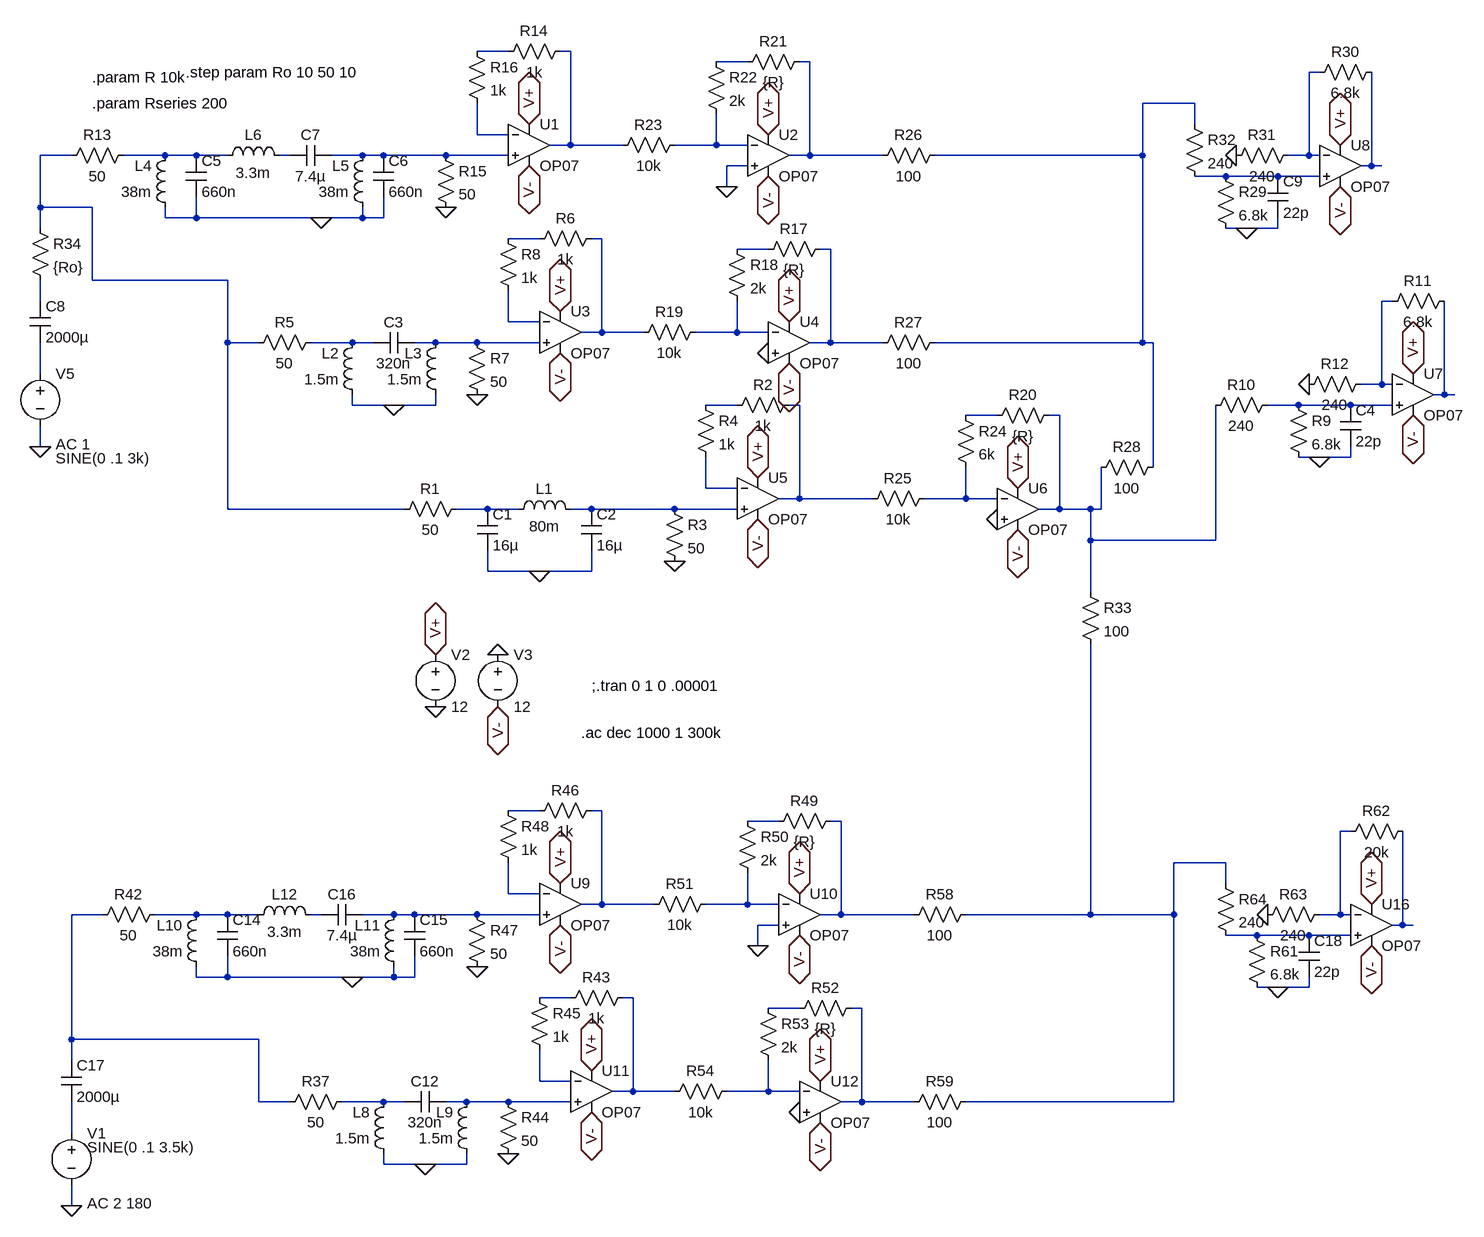
[diagram p0: schematic use_this_for_simulations_on_Mac_test_singleBASS.asc]
use_this_for_simulations_on_Mac_test_singleBASS.asc, the LTspice schematic file:
Version 4
SHEET 1 1344 1392
WIRE -176 -592 -224 -592
WIRE -80 -592 -96 -592
WIRE 192 -576 144 -576
WIRE 288 -576 272 -576
WIRE 1072 -560 1056 -560
WIRE 880 -512 800 -512
WIRE 880 -480 880 -512
WIRE -224 -464 -224 -512
WIRE -176 -464 -224 -464
WIRE -80 -448 -80 -592
WIRE -80 -448 -112 -448
WIRE 0 -448 -80 -448
WIRE 144 -448 144 -496
WIRE 144 -448 80 -448
WIRE 192 -448 144 -448
WIRE -848 -432 -896 -432
WIRE -704 -432 -768 -432
WIRE -656 -432 -704 -432
WIRE -608 -432 -656 -432
WIRE -512 -432 -528 -432
WIRE -400 -432 -448 -432
WIRE -368 -432 -400 -432
WIRE -272 -432 -368 -432
WIRE -176 -432 -272 -432
WIRE 288 -432 288 -576
WIRE 288 -432 256 -432
WIRE 400 -432 288 -432
WIRE 800 -432 800 -512
WIRE 800 -432 480 -432
WIRE 1056 -432 1056 -560
WIRE 1056 -432 1024 -432
WIRE 1072 -432 1056 -432
WIRE 192 -416 160 -416
WIRE 1152 -416 1152 -560
WIRE 1152 -416 1136 -416
WIRE 1168 -416 1152 -416
WIRE 928 -400 880 -400
WIRE 1008 -400 928 -400
WIRE 1072 -400 1008 -400
WIRE 160 -384 160 -416
WIRE -896 -352 -896 -432
WIRE -816 -352 -896 -352
WIRE -704 -336 -704 -352
WIRE -656 -336 -656 -368
WIRE -656 -336 -704 -336
WIRE -464 -336 -656 -336
WIRE -400 -336 -400 -352
WIRE -400 -336 -464 -336
WIRE -368 -336 -368 -368
WIRE -368 -336 -400 -336
WIRE -896 -320 -896 -352
WIRE 960 -320 928 -320
WIRE 1008 -320 1008 -336
WIRE 1008 -320 960 -320
WIRE -128 -304 -176 -304
WIRE -32 -304 -48 -304
WIRE 224 -288 176 -288
WIRE 320 -288 304 -288
WIRE -816 -240 -816 -352
WIRE -608 -240 -816 -240
WIRE -896 -208 -896 -240
WIRE 1184 -208 1168 -208
WIRE -176 -176 -176 -224
WIRE -128 -176 -176 -176
WIRE -32 -160 -32 -304
WIRE -32 -160 -64 -160
WIRE 32 -160 -32 -160
WIRE 176 -160 176 -208
WIRE 176 -160 112 -160
WIRE 224 -160 176 -160
WIRE -608 -144 -608 -240
WIRE -560 -144 -608 -144
WIRE -416 -144 -480 -144
WIRE -384 -144 -416 -144
WIRE -288 -144 -320 -144
WIRE -224 -144 -288 -144
WIRE -128 -144 -224 -144
WIRE 320 -144 320 -288
WIRE 320 -144 288 -144
WIRE 400 -144 320 -144
WIRE 800 -144 800 -432
WIRE 800 -144 480 -144
WIRE 816 -144 800 -144
WIRE -896 -96 -896 -144
WIRE 1168 -80 1168 -208
WIRE 1168 -80 1136 -80
WIRE 1184 -80 1168 -80
WIRE 1264 -64 1264 -208
WIRE 1264 -64 1248 -64
WIRE 1280 -64 1264 -64
WIRE -416 -48 -416 -64
WIRE -352 -48 -416 -48
WIRE -288 -48 -288 -64
WIRE -288 -48 -352 -48
WIRE 176 -48 128 -48
WIRE 272 -48 256 -48
WIRE 1040 -48 992 -48
WIRE 1120 -48 1040 -48
WIRE 1184 -48 1120 -48
WIRE 576 -32 528 -32
WIRE 672 -32 656 -32
WIRE -896 16 -896 -16
WIRE 1072 32 1040 32
WIRE 1120 32 1120 16
WIRE 1120 32 1072 32
WIRE 816 48 816 -144
WIRE 128 80 128 32
WIRE 176 80 128 80
WIRE 272 96 272 -48
WIRE 272 96 240 96
WIRE 384 96 272 96
WIRE 528 96 528 48
WIRE 528 96 464 96
WIRE 576 96 528 96
WIRE -608 112 -608 -144
WIRE -336 112 -608 112
WIRE -208 112 -256 112
WIRE -160 112 -208 112
WIRE -48 112 -80 112
WIRE 80 112 -48 112
WIRE 176 112 80 112
WIRE 672 112 672 -32
WIRE 672 112 640 112
WIRE 720 112 672 112
WIRE 736 112 736 48
WIRE 736 112 720 112
WIRE 720 160 720 112
WIRE 912 160 912 -48
WIRE 912 160 720 160
WIRE -208 208 -208 176
WIRE -128 208 -208 208
WIRE -48 208 -48 176
WIRE -48 208 -128 208
WIRE 720 240 720 160
WIRE -128 576 -176 576
WIRE -32 576 -48 576
WIRE 240 592 192 592
WIRE 336 592 320 592
WIRE 1120 608 1104 608
WIRE 928 656 848 656
WIRE 928 688 928 656
WIRE -176 704 -176 656
WIRE -128 704 -176 704
WIRE -32 720 -32 576
WIRE -32 720 -64 720
WIRE 48 720 -32 720
WIRE 192 720 192 672
WIRE 192 720 128 720
WIRE 240 720 192 720
WIRE -800 736 -848 736
WIRE -656 736 -720 736
WIRE -608 736 -656 736
WIRE -560 736 -608 736
WIRE -464 736 -480 736
WIRE -352 736 -400 736
WIRE -320 736 -352 736
WIRE -224 736 -320 736
WIRE -128 736 -224 736
WIRE 336 736 336 592
WIRE 336 736 304 736
WIRE 448 736 336 736
WIRE 720 736 720 320
WIRE 720 736 528 736
WIRE 848 736 848 656
WIRE 848 736 720 736
WIRE 1104 736 1104 608
WIRE 1104 736 1072 736
WIRE 1120 736 1104 736
WIRE 240 752 208 752
WIRE 1200 752 1200 608
WIRE 1200 752 1184 752
WIRE 1216 752 1200 752
WIRE 976 768 928 768
WIRE 1056 768 976 768
WIRE 1120 768 1056 768
WIRE 208 784 208 752
WIRE -656 832 -656 816
WIRE -608 832 -608 800
WIRE -608 832 -656 832
WIRE -416 832 -608 832
WIRE -352 832 -352 816
WIRE -352 832 -416 832
WIRE -320 832 -320 800
WIRE -320 832 -352 832
WIRE 1008 848 976 848
WIRE 1056 848 1056 832
WIRE 1056 848 1008 848
WIRE -80 864 -128 864
WIRE 16 864 0 864
WIRE 272 880 224 880
WIRE 368 880 352 880
WIRE -848 928 -848 736
WIRE -560 928 -848 928
WIRE -848 960 -848 928
WIRE -128 992 -128 944
WIRE -80 992 -128 992
WIRE 16 1008 16 864
WIRE 16 1008 -16 1008
WIRE 80 1008 16 1008
WIRE 224 1008 224 960
WIRE 224 1008 160 1008
WIRE 272 1008 224 1008
WIRE -560 1024 -560 928
WIRE -512 1024 -560 1024
WIRE -368 1024 -432 1024
WIRE -336 1024 -368 1024
WIRE -240 1024 -272 1024
WIRE -176 1024 -240 1024
WIRE -80 1024 -176 1024
WIRE 368 1024 368 880
WIRE 368 1024 336 1024
WIRE 448 1024 368 1024
WIRE 848 1024 848 736
WIRE 848 1024 528 1024
WIRE -848 1072 -848 1024
WIRE -368 1120 -368 1104
WIRE -304 1120 -368 1120
WIRE -240 1120 -240 1104
WIRE -240 1120 -304 1120
WIRE -848 1184 -848 1152
FLAG -288 336 V+
IOPIN -288 336 BiDir
FLAG 208 64 V+
IOPIN 208 64 BiDir
FLAG -192 416 V-
IOPIN -192 416 BiDir
FLAG 208 128 V-
IOPIN 208 128 BiDir
FLAG -192 336 0
FLAG -288 416 0
FLAG -128 208 0
FLAG -352 -48 0
FLAG 1216 -96 V+
IOPIN 1216 -96 BiDir
FLAG 1216 -32 V-
IOPIN 1216 -32 BiDir
FLAG 1072 32 0
FLAG 1056 -80 0
FLAG -896 16 0
FLAG -464 -336 0
FLAG 80 192 0
FLAG -96 -192 V+
IOPIN -96 -192 BiDir
FLAG -96 -128 V-
IOPIN -96 -128 BiDir
FLAG -224 -64 0
FLAG -144 -480 V+
IOPIN -144 -480 BiDir
FLAG -144 -416 V-
IOPIN -144 -416 BiDir
FLAG -272 -352 0
FLAG 224 -464 V+
IOPIN 224 -464 BiDir
FLAG 224 -400 V-
IOPIN 224 -400 BiDir
FLAG 256 -176 V+
IOPIN 256 -176 BiDir
FLAG 256 -112 V-
IOPIN 256 -112 BiDir
FLAG 608 80 V+
IOPIN 608 80 BiDir
FLAG 608 144 V-
IOPIN 608 144 BiDir
FLAG 224 -128 0
FLAG 160 -384 0
FLAG 576 128 0
FLAG 1104 -448 V+
IOPIN 1104 -448 BiDir
FLAG 1104 -384 V-
IOPIN 1104 -384 BiDir
FLAG 960 -320 0
FLAG 944 -432 0
FLAG -304 1120 0
FLAG -848 1184 0
FLAG -416 832 0
FLAG -48 976 V+
IOPIN -48 976 BiDir
FLAG -48 1040 V-
IOPIN -48 1040 BiDir
FLAG -176 1104 0
FLAG -96 688 V+
IOPIN -96 688 BiDir
FLAG -96 752 V-
IOPIN -96 752 BiDir
FLAG -224 816 0
FLAG 272 704 V+
IOPIN 272 704 BiDir
FLAG 272 768 V-
IOPIN 272 768 BiDir
FLAG 304 992 V+
IOPIN 304 992 BiDir
FLAG 304 1056 V-
IOPIN 304 1056 BiDir
FLAG 272 1040 0
FLAG 208 784 0
FLAG 1152 720 V+
IOPIN 1152 720 BiDir
FLAG 1152 784 V-
IOPIN 1152 784 BiDir
FLAG 1008 848 0
FLAG 992 736 0
SYMBOL voltage -288 320 R0
WINDOW 123 0 0 Left 2
WINDOW 39 0 0 Left 2
SYMATTR InstName V2
SYMATTR Value 12
SYMBOL voltage -192 320 R0
WINDOW 123 0 0 Left 2
WINDOW 39 0 0 Left 2
SYMATTR InstName V3
SYMATTR Value 12
SYMBOL res -240 96 R90
WINDOW 0 0 56 VBottom 2
WINDOW 3 32 56 VTop 2
SYMATTR InstName R1
SYMATTR Value 50
SYMBOL res 272 -64 R90
WINDOW 0 0 56 VBottom 2
WINDOW 3 32 56 VTop 2
SYMATTR InstName R2
SYMATTR Value 1k
SYMBOL cap -224 112 R0
SYMATTR InstName C1
SYMATTR Value 16µ
SYMBOL ind -176 128 R270
WINDOW 0 32 56 VTop 2
WINDOW 3 5 56 VBottom 2
SYMATTR InstName L1
SYMATTR Value 80m
SYMATTR SpiceLine Rser={Rseries}
SYMBOL cap -64 112 R0
SYMATTR InstName C2
SYMATTR Value 16µ
SYMBOL res 64 96 R0
SYMATTR InstName R3
SYMATTR Value 50
SYMBOL res 112 -64 R0
SYMATTR InstName R4
SYMATTR Value 1k
SYMBOL res -464 -160 R90
WINDOW 0 0 56 VBottom 2
WINDOW 3 32 56 VTop 2
SYMATTR InstName R5
SYMATTR Value 50
SYMBOL cap -384 -128 R270
WINDOW 0 32 32 VTop 2
WINDOW 3 0 32 VBottom 2
SYMATTR InstName C3
SYMATTR Value 320n
SYMBOL ind -400 -48 R180
WINDOW 0 36 80 Left 2
WINDOW 3 36 40 Left 2
SYMATTR InstName L2
SYMATTR Value 1.5m
SYMBOL ind -272 -48 R180
WINDOW 0 36 80 Left 2
WINDOW 3 36 40 Left 2
SYMATTR InstName L3
SYMATTR Value 1.5m
SYMBOL cap 1104 -48 R0
SYMATTR InstName C4
SYMATTR Value 22p
SYMBOL res 1024 -64 R0
SYMATTR InstName R9
SYMATTR Value 6.8k
SYMBOL res 896 -32 R270
WINDOW 0 32 56 VTop 2
WINDOW 3 0 56 VBottom 2
SYMATTR InstName R10
SYMATTR Value 240
SYMBOL res 1168 -192 R270
WINDOW 0 32 56 VTop 2
WINDOW 3 0 56 VBottom 2
SYMATTR InstName R11
SYMATTR Value 6.8k
SYMBOL res 1040 -64 R270
WINDOW 0 32 56 VTop 2
WINDOW 3 0 56 VBottom 2
SYMATTR InstName R12
SYMATTR Value 240
SYMBOL voltage -896 -112 R0
WINDOW 123 24 124 Left 2
WINDOW 39 0 0 Left 2
WINDOW 3 24 146 Left 2
SYMATTR Value2 AC 1
SYMATTR Value SINE(0 .1 3k)
SYMATTR InstName V5
SYMBOL res -752 -448 R90
WINDOW 0 0 56 VBottom 2
WINDOW 3 32 56 VTop 2
SYMATTR InstName R13
SYMATTR Value 50
SYMBOL ind -688 -336 R180
WINDOW 0 36 80 Left 2
WINDOW 3 36 40 Left 2
SYMATTR InstName L4
SYMATTR Value 38m
SYMBOL ind -384 -336 R180
WINDOW 0 36 80 Left 2
WINDOW 3 36 40 Left 2
SYMATTR InstName L5
SYMATTR Value 38m
SYMBOL cap -672 -432 R0
SYMATTR InstName C5
SYMATTR Value 660n
SYMBOL cap -384 -432 R0
SYMATTR InstName C6
SYMATTR Value 660n
SYMBOL ind -624 -416 R270
WINDOW 0 32 56 VTop 2
WINDOW 3 5 56 VBottom 2
SYMATTR InstName L6
SYMATTR Value 3.3m
SYMBOL cap -512 -416 R270
WINDOW 0 32 32 VTop 2
WINDOW 3 0 32 VBottom 2
SYMATTR InstName C7
SYMATTR Value 7.4µ
SYMBOL res -32 -320 R90
WINDOW 0 0 56 VBottom 2
WINDOW 3 32 56 VTop 2
SYMATTR InstName R6
SYMATTR Value 1k
SYMBOL res -240 -160 R0
SYMATTR InstName R7
SYMATTR Value 50
SYMBOL res -192 -320 R0
SYMATTR InstName R8
SYMATTR Value 1k
SYMBOL res -80 -608 R90
WINDOW 0 0 56 VBottom 2
WINDOW 3 32 56 VTop 2
SYMATTR InstName R14
SYMATTR Value 1k
SYMBOL res -288 -448 R0
SYMATTR InstName R15
SYMATTR Value 50
SYMBOL res -240 -608 R0
SYMATTR InstName R16
SYMATTR Value 1k
SYMBOL res 288 -592 R90
WINDOW 0 0 56 VBottom 2
WINDOW 3 32 56 VTop 2
SYMATTR InstName R21
SYMATTR Value {R}
SYMBOL res 128 -592 R0
SYMATTR InstName R22
SYMATTR Value 2k
SYMBOL res -16 -432 R270
WINDOW 0 32 56 VTop 2
WINDOW 3 0 56 VBottom 2
SYMATTR InstName R23
SYMATTR Value 10k
SYMBOL res 320 -304 R90
WINDOW 0 0 56 VBottom 2
WINDOW 3 32 56 VTop 2
SYMATTR InstName R17
SYMATTR Value {R}
SYMBOL res 160 -304 R0
SYMATTR InstName R18
SYMATTR Value 2k
SYMBOL res 16 -144 R270
WINDOW 0 32 56 VTop 2
WINDOW 3 0 56 VBottom 2
SYMATTR InstName R19
SYMATTR Value 10k
SYMBOL res 672 -48 R90
WINDOW 0 0 56 VBottom 2
WINDOW 3 32 56 VTop 2
SYMATTR InstName R20
SYMATTR Value {R}
SYMBOL res 512 -48 R0
SYMATTR InstName R24
SYMATTR Value 6k
SYMBOL res 368 112 R270
WINDOW 0 32 56 VTop 2
WINDOW 3 0 56 VBottom 2
SYMATTR InstName R25
SYMATTR Value 10k
SYMBOL res 384 -416 R270
WINDOW 0 32 56 VTop 2
WINDOW 3 0 56 VBottom 2
SYMATTR InstName R26
SYMATTR Value 100
SYMBOL res 384 -128 R270
WINDOW 0 32 56 VTop 2
WINDOW 3 0 56 VBottom 2
SYMATTR InstName R27
SYMATTR Value 100
SYMBOL res 720 64 R270
WINDOW 0 32 56 VTop 2
WINDOW 3 0 56 VBottom 2
SYMATTR InstName R28
SYMATTR Value 100
SYMBOL cap -912 -208 R0
SYMATTR InstName C8
SYMATTR Value 2000µ
SYMBOL Opamps/OP07 -144 -512 R0
SYMATTR InstName U1
SYMBOL Opamps/OP07 224 -496 R0
SYMATTR InstName U2
SYMBOL Opamps/OP07 -96 -224 R0
SYMATTR InstName U3
SYMBOL Opamps/OP07 256 -208 R0
SYMATTR InstName U4
SYMBOL Opamps/OP07 208 32 R0
SYMATTR InstName U5
SYMBOL Opamps/OP07 608 48 R0
SYMATTR InstName U6
SYMBOL Opamps/OP07 1216 -128 R0
SYMATTR InstName U7
SYMBOL cap 992 -400 R0
SYMATTR InstName C9
SYMATTR Value 22p
SYMBOL res 912 -416 R0
SYMATTR InstName R29
SYMATTR Value 6.8k
SYMBOL res 1056 -544 R270
WINDOW 0 32 56 VTop 2
WINDOW 3 0 56 VBottom 2
SYMATTR InstName R30
SYMATTR Value 6.8k
SYMBOL res 928 -416 R270
WINDOW 0 32 56 VTop 2
WINDOW 3 0 56 VBottom 2
SYMATTR InstName R31
SYMATTR Value 240
SYMBOL Opamps/OP07 1104 -480 R0
SYMATTR InstName U8
SYMBOL res 864 -496 R0
SYMATTR InstName R32
SYMATTR Value 240
SYMBOL res -416 1008 R90
WINDOW 0 0 56 VBottom 2
WINDOW 3 32 56 VTop 2
SYMATTR InstName R37
SYMATTR Value 50
SYMBOL cap -336 1040 R270
WINDOW 0 32 32 VTop 2
WINDOW 3 0 32 VBottom 2
SYMATTR InstName C12
SYMATTR Value 320n
SYMBOL ind -352 1120 R180
WINDOW 0 36 80 Left 2
WINDOW 3 36 40 Left 2
SYMATTR InstName L8
SYMATTR Value 1.5m
SYMBOL ind -224 1120 R180
WINDOW 0 36 80 Left 2
WINDOW 3 36 40 Left 2
SYMATTR InstName L9
SYMATTR Value 1.5m
SYMBOL voltage -848 1056 R0
WINDOW 123 24 124 Left 2
WINDOW 39 0 0 Left 2
WINDOW 3 24 38 Left 2
SYMATTR Value2 AC 2 180
SYMATTR Value SINE(0 .1 3.5k)
SYMATTR InstName V1
SYMBOL res -704 720 R90
WINDOW 0 0 56 VBottom 2
WINDOW 3 32 56 VTop 2
SYMATTR InstName R42
SYMATTR Value 50
SYMBOL ind -640 832 R180
WINDOW 0 36 80 Left 2
WINDOW 3 36 40 Left 2
SYMATTR InstName L10
SYMATTR Value 38m
SYMBOL ind -336 832 R180
WINDOW 0 36 80 Left 2
WINDOW 3 36 40 Left 2
SYMATTR InstName L11
SYMATTR Value 38m
SYMBOL cap -624 736 R0
SYMATTR InstName C14
SYMATTR Value 660n
SYMBOL cap -336 736 R0
SYMATTR InstName C15
SYMATTR Value 660n
SYMBOL ind -576 752 R270
WINDOW 0 32 56 VTop 2
WINDOW 3 5 56 VBottom 2
SYMATTR InstName L12
SYMATTR Value 3.3m
SYMBOL cap -464 752 R270
WINDOW 0 32 32 VTop 2
WINDOW 3 0 32 VBottom 2
SYMATTR InstName C16
SYMATTR Value 7.4µ
SYMBOL res 16 848 R90
WINDOW 0 0 56 VBottom 2
WINDOW 3 32 56 VTop 2
SYMATTR InstName R43
SYMATTR Value 1k
SYMBOL res -192 1008 R0
SYMATTR InstName R44
SYMATTR Value 50
SYMBOL res -144 848 R0
SYMATTR InstName R45
SYMATTR Value 1k
SYMBOL res -32 560 R90
WINDOW 0 0 56 VBottom 2
WINDOW 3 32 56 VTop 2
SYMATTR InstName R46
SYMATTR Value 1k
SYMBOL res -240 720 R0
SYMATTR InstName R47
SYMATTR Value 50
SYMBOL res -192 560 R0
SYMATTR InstName R48
SYMATTR Value 1k
SYMBOL res 336 576 R90
WINDOW 0 0 56 VBottom 2
WINDOW 3 32 56 VTop 2
SYMATTR InstName R49
SYMATTR Value {R}
SYMBOL res 176 576 R0
SYMATTR InstName R50
SYMATTR Value 2k
SYMBOL res 32 736 R270
WINDOW 0 32 56 VTop 2
WINDOW 3 0 56 VBottom 2
SYMATTR InstName R51
SYMATTR Value 10k
SYMBOL res 368 864 R90
WINDOW 0 0 56 VBottom 2
WINDOW 3 32 56 VTop 2
SYMATTR InstName R52
SYMATTR Value {R}
SYMBOL res 208 864 R0
SYMATTR InstName R53
SYMATTR Value 2k
SYMBOL res 64 1024 R270
WINDOW 0 32 56 VTop 2
WINDOW 3 0 56 VBottom 2
SYMATTR InstName R54
SYMATTR Value 10k
SYMBOL res 432 752 R270
WINDOW 0 32 56 VTop 2
WINDOW 3 0 56 VBottom 2
SYMATTR InstName R58
SYMATTR Value 100
SYMBOL res 432 1040 R270
WINDOW 0 32 56 VTop 2
WINDOW 3 0 56 VBottom 2
SYMATTR InstName R59
SYMATTR Value 100
SYMBOL cap -864 960 R0
SYMATTR InstName C17
SYMATTR Value 2000µ
SYMBOL Opamps/OP07 -96 656 R0
SYMATTR InstName U9
SYMBOL Opamps/OP07 272 672 R0
SYMATTR InstName U10
SYMBOL Opamps/OP07 -48 944 R0
SYMATTR InstName U11
SYMBOL Opamps/OP07 304 960 R0
SYMATTR InstName U12
SYMBOL cap 1040 768 R0
SYMATTR InstName C18
SYMATTR Value 22p
SYMBOL res 960 752 R0
SYMATTR InstName R61
SYMATTR Value 6.8k
SYMBOL res 1104 624 R270
WINDOW 0 32 56 VTop 2
WINDOW 3 0 56 VBottom 2
SYMATTR InstName R62
SYMATTR Value 20k
SYMBOL res 976 752 R270
WINDOW 0 32 56 VTop 2
WINDOW 3 0 56 VBottom 2
SYMATTR InstName R63
SYMATTR Value 240
SYMBOL Opamps/OP07 1152 688 R0
SYMATTR InstName U16
SYMBOL res 912 672 R0
SYMATTR InstName R64
SYMATTR Value 240
SYMBOL res 704 224 R0
SYMATTR InstName R33
SYMATTR Value 100
SYMBOL res -912 -336 R0
SYMATTR InstName R34
SYMATTR Value {Ro}
TEXT -64 456 Left 2 !.ac dec 1000 1 300k
TEXT -672 -560 Left 2 !.step param Ro 10 50 10
TEXT -816 -552 Left 2 !.param R 10k
TEXT -816 -512 Left 2 !.param Rseries 200
TEXT -48 384 Left 2 !;.tran 0 1 0 .00001

The netlist it stands for:
* use_this_for_simulations_on_Mac_test_singleBASS.asc
V2 V+ 0 12
V3 0 V- 12
R1 N034 N009 50
R2 N028 N027 1k
C1 N034 0 16µ
L1 N034 N035 80m Rser={Rseries}
C2 N035 0 16µ
R3 N035 0 50
R4 N027 N032 1k
R5 N023 N009 50
C3 N023 N024 320n
L2 0 N023 1.5m
L3 0 N024 1.5m
C4 N029 0 22p
R9 N029 0 6.8k
R10 N031 N029 240
R11 N020 N026 6.8k
R12 0 N020 240
V5 N025 0 SINE(0 .1 3k) AC 1
R13 N010 N009 50
L4 0 N010 38m
L5 0 N012 38m
C5 N010 0 660n
C6 N012 0 660n
L6 N010 N011 3.3m
C7 N011 N012 7.4µ
R6 N016 N015 1k
R7 N024 0 50
R8 N015 N021 1k
R14 N002 N001 1k
R15 N012 0 50
R16 N001 N007 1k
R21 N004 N003 {R}
R22 N003 N008 2k
R23 N002 N008 10k
R17 N018 N017 {R}
R18 N017 N022 2k
R19 N016 N022 10k
R20 N031 N030 {R}
R24 N030 N033 6k
R25 N028 N033 10k
R26 N004 N006 100
R27 N018 N006 100
R28 N031 N006 100
C8 N019 N025 2000µ
XU1 N012 N007 V+ V- N002 LT1001  ; OP07, pins In+ In- V+ V- OUT
XU2 0 N008 V+ V- N004 LT1001  ; OP07, pins In+ In- V+ V- OUT
XU3 N024 N021 V+ V- N016 LT1001  ; OP07, pins In+ In- V+ V- OUT
XU4 0 N022 V+ V- N018 LT1001  ; OP07, pins In+ In- V+ V- OUT
XU5 N035 N032 V+ V- N028 LT1001  ; OP07, pins In+ In- V+ V- OUT
XU6 0 N033 V+ V- N031 LT1001  ; OP07, pins In+ In- V+ V- OUT
XU7 N029 N020 V+ V- N026 LT1001  ; OP07, pins In+ In- V+ V- OUT
C9 N014 0 22p
R29 N014 0 6.8k
R30 N005 N013 6.8k
R31 0 N005 240
XU8 N014 N005 V+ V- N013 LT1001  ; OP07, pins In+ In- V+ V- OUT
R32 N006 N014 240
R37 N056 N044 50
C12 N056 N057 320n
L8 0 N056 1.5m
L9 0 N057 1.5m
V1 N058 0 SINE(0 .1 3.5k) AC 2 180
R42 N045 N044 50
L10 0 N045 38m
L11 0 N047 38m
C14 N045 0 660n
C15 N047 0 660n
L12 N045 N046 3.3m
C16 N046 N047 7.4µ
R43 N051 N050 1k
R44 N057 0 50
R45 N050 N054 1k
R46 N037 N036 1k
R47 N047 0 50
R48 N036 N042 1k
R49 N039 N038 {R}
R50 N038 N043 2k
R51 N037 N043 10k
R52 N053 N052 {R}
R53 N052 N055 2k
R54 N051 N055 10k
R58 N039 N041 100
R59 N053 N041 100
C17 N044 N058 2000µ
XU9 N047 N042 V+ V- N037 LT1001  ; OP07, pins In+ In- V+ V- OUT
XU10 0 N043 V+ V- N039 LT1001  ; OP07, pins In+ In- V+ V- OUT
XU11 N057 N054 V+ V- N051 LT1001  ; OP07, pins In+ In- V+ V- OUT
XU12 0 N055 V+ V- N053 LT1001  ; OP07, pins In+ In- V+ V- OUT
C18 N049 0 22p
R61 N049 0 6.8k
R62 N040 N048 20k
R63 0 N040 240
XU16 N049 N040 V+ V- N048 LT1001  ; OP07, pins In+ In- V+ V- OUT
R64 N041 N049 240
R33 N031 N041 100
R34 N009 N019 {Ro}
.ac dec 1000 1 300k
.step param Ro 10 50 10
.param R 10k
.param Rseries 200
;.tran 0 1 0 .00001
.lib LTC.lib
.backanno
.end